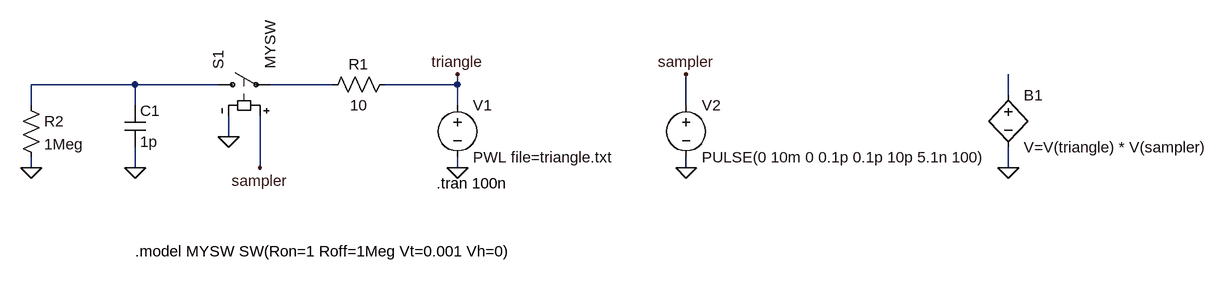
[diagram p0: schematic ETB_Osc.asc]
ETB_Osc.asc, the LTspice schematic file:
Version 4
SHEET 1 1256 680
WIRE -448 96 -608 96
WIRE -320 96 -448 96
WIRE -144 96 -240 96
WIRE 48 96 48 80
WIRE 48 96 -64 96
WIRE 896 112 896 80
WIRE -608 128 -608 96
WIRE -448 128 -448 96
WIRE 48 128 48 96
WIRE 400 128 400 80
WIRE -304 176 -304 144
WIRE -608 224 -608 208
WIRE -448 224 -448 192
WIRE -256 224 -256 144
WIRE 48 224 48 208
WIRE 400 224 400 208
WIRE 896 224 896 192
FLAG 48 224 0
FLAG 48 80 triangle
FLAG 400 224 0
FLAG 400 80 sampler
FLAG 896 224 0
FLAG -448 224 0
FLAG -256 224 sampler
FLAG -304 176 0
FLAG -608 224 0
SYMBOL voltage 48 112 R0
WINDOW 123 0 0 Left 2
WINDOW 39 0 0 Left 2
SYMATTR InstName V1
SYMATTR Value PWL file=triangle.txt
SYMBOL voltage 400 112 R0
WINDOW 123 0 0 Left 2
WINDOW 39 0 0 Left 2
SYMATTR InstName V2
SYMATTR Value PULSE(0 10m 0 0.1p 0.1p 10p 5.1n 100)
SYMBOL bv 896 96 R0
SYMATTR InstName B1
SYMATTR Value V=V(triangle) * V(sampler)
SYMBOL res -48 80 R90
WINDOW 0 0 56 VBottom 2
WINDOW 3 32 56 VTop 2
SYMATTR InstName R1
SYMATTR Value 10
SYMBOL cap -464 128 R0
SYMATTR InstName C1
SYMATTR Value 1p
SYMBOL sw -336 96 R270
SYMATTR InstName S1
SYMATTR Value MYSW
SYMBOL res -624 112 R0
SYMATTR InstName R2
SYMATTR Value 1Meg
TEXT 16 248 Left 2 !.tran 100n
TEXT -448 352 Left 2 !.model MYSW SW(Ron=1 Roff=1Meg Vt=0.001 Vh=0)

The netlist it stands for:
* ETB_Osc.asc
V1 triangle 0 PWL file=triangle.txt
V2 sampler 0 PULSE(0 10m 0 0.1p 0.1p 10p 5.1n 100)
B1 N003 0 V=V(triangle) * V(sampler)
R1 triangle N002 10
C1 N001 0 1p
S1 N001 N002 sampler 0 MYSW
R2 N001 0 1Meg
.tran 100n
.model MYSW SW(Ron=1 Roff=1Meg Vt=0.001 Vh=0)
.backanno
.end

* Results of the author's LTspice run, read from the files saved beside the schematic
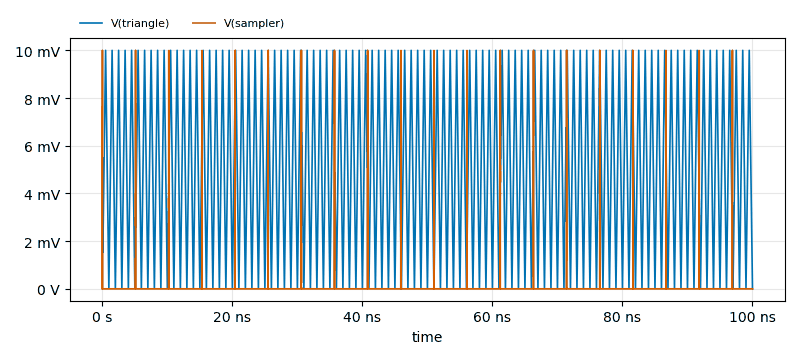
[diagram p1: Transient Analysis of ETB_Osc.asc, plotted from the saved traces]
* Transient Analysis, 1 run:
*   V(triangle): min 0 V, max 10 mV, average 5 mV, rms 6.991 mV, last 0 V
*   V(sampler): min 0 V, max 10 mV, average 20.2 µV, rms 448.8 µV, last 0 V